# EAGLE design amp_interface_v_1_0 (EAGLE 6.4)
PyRadio
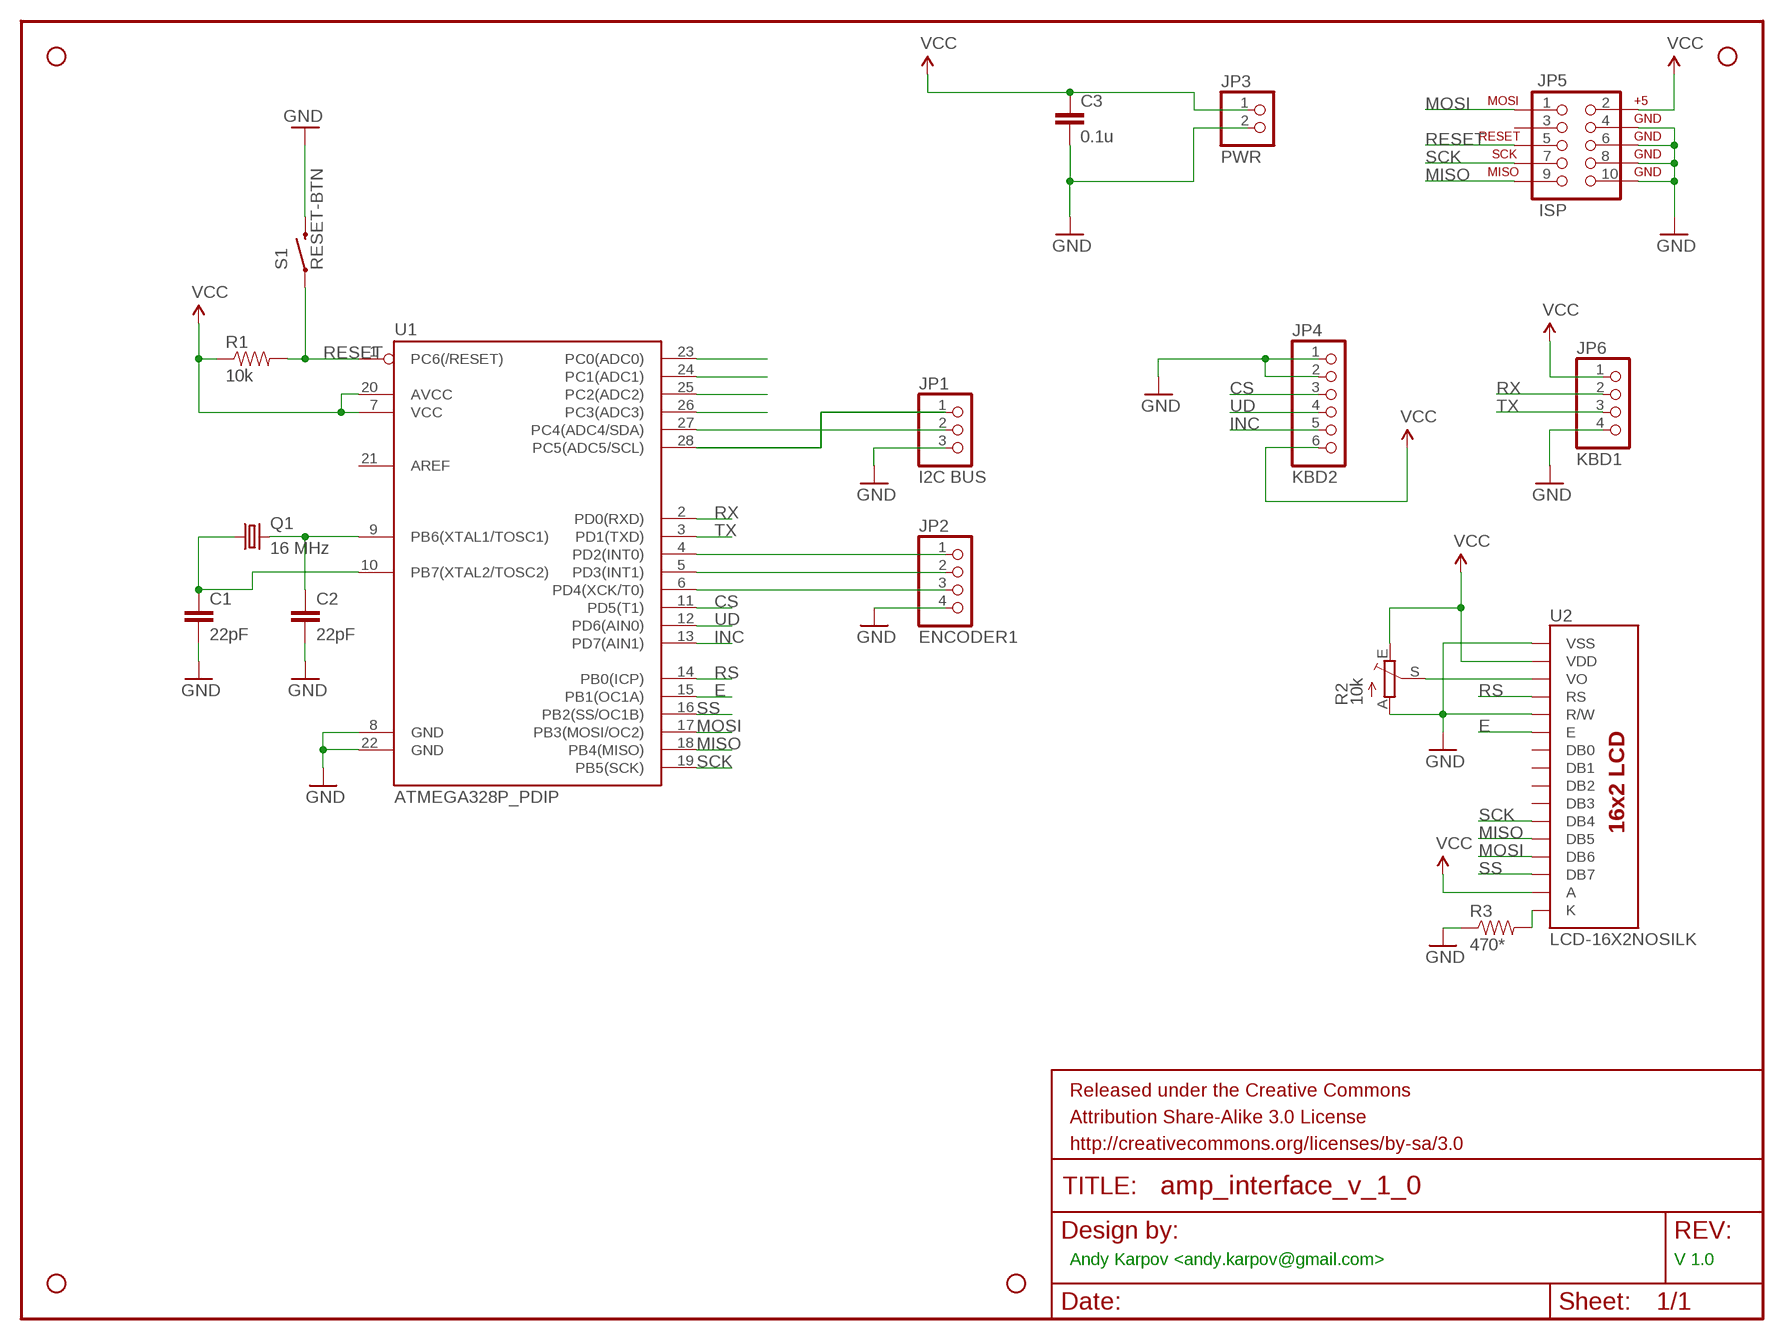
[diagram p0: schematic, sheet 1]

## Parts
C1  22pF  CAPPTH2  [CAP-PTH-SMALL2]
C2  22pF  CAPPTH2  [CAP-PTH-SMALL2]
C3  0.1u  CAPPTH2  [CAP-PTH-SMALL2]
FRAME1  FRAME-LETTER  [CREATIVE_COMMONS]
JP1  I2C BUS  PINHD-1X3  [1X03]
JP2  ENCODER1  PINHD-1X4  [1X04]
JP3  PWR  PINHD-1X2  [1X02]
JP4  KBD2  PINHD-1X6  [1X06]
JP5  ISP  AVR_SPI_PROG2PTH2  [2X5-SHROUDED]
JP6  KBD1  PINHD-1X4  [1X04]
Q1  16 MHz  CRYSTALHC49S  [HC49/S]
R1  10k  RESISTORPTH-1/4W  [AXIAL-0.4]
R2  10k  TRIM_EU-B64Y  [B64Y]
R3  470*  RESISTORPTH-1/4W  [AXIAL-0.4]
S1  RESET-BTN  SWITCH-MOMENTARY-2PTH  [TACTILE-PTH]
STANDOFF1  STAND-OFF  [STAND-OFF]
STANDOFF2  STAND-OFF  [STAND-OFF]
STANDOFF3  STAND-OFF  [STAND-OFF]
STANDOFF4  STAND-OFF  [STAND-OFF]
U1  ATMEGA328P_PDIP  [DIL28-3]
U2  LCD-16X2NOSILK  [LCD-16X2_NOSILK]

## Nets
CS: JP4.3 U1.11(PD5(T1))
E: U1.15(PB1(OC1A)) U2.6(E)
GND: C1.2 C2.2 C3.2 JP1.3 JP2.4 JP3.2 JP4.1 JP4.2 JP5.4 JP5.6 JP5.8 JP5.10 JP6.4 R2.A R3.P$1 S1.3 U1.8(GND) U1.22(GND) U2.1(VSS) U2.5(R/W)
INC: JP4.5 U1.13(PD7(AIN1))
MISO: JP5.9 U1.18(PB4(MISO)) U2.12(DB5)
MOSI: JP5.1 U1.17(PB3(MOSI/OC2)) U2.13(DB6)
N$1: C2.1 Q1.2 U1.9(PB6(XTAL1/TOSC1))
N$2: C1.1 Q1.1 U1.10(PB7(XTAL2/TOSC2))
N$3: R2.S U2.3(VO)
N$4: R3.P$2 U2.16(K)
N$6: JP1.2 U1.27(PC4(ADC4/SDA))
N$7: JP1.1 U1.28(PC5(ADC5/SCL))
N$20: JP2.3 U1.6(PD4(XCK/T0))
N$21: JP2.1 U1.4(PD2(INT0))
N$24: JP2.2 U1.5(PD3(INT1))
PC0: U1.23(PC0(ADC0))
PC1: U1.24(PC1(ADC1))
PC2: U1.25(PC2(ADC2))
PC3: U1.26(PC3(ADC3))
RESET: JP5.5 R1.P$2 S1.1 U1.1(PC6(/RESET))
RS: U1.14(PB0(ICP)) U2.4(RS)
RX: JP6.2 U1.2(PD0(RXD))
SCK: JP5.7 U1.19(PB5(SCK)) U2.11(DB4)
SS: U1.16(PB2(SS/OC1B)) U2.14(DB7)
TX: JP6.3 U1.3(PD1(TXD))
UD: JP4.4 U1.12(PD6(AIN0))
VCC: C3.1 JP3.1 JP4.6 JP5.2 JP6.1 R1.P$1 R2.E U1.7(VCC) U1.20(AVCC) U2.2(VDD) U2.15(A)
Unconnected: JP5.3 U1.21(AREF) U2.7(DB0) U2.8(DB1) U2.9(DB2) U2.10(DB3)

## Notes on the sheet
- Andy Karpov <andy.karpov@gmail.com> | V 1.0

## Library data of the parts
C1-C3 = SparkFun-Passives:CAP: Capacitor Standard 0603 ceramic capacitor, and 0.1" leaded capacitor.
FRAME1 = SparkFun-Aesthetics:FRAME-LETTER: Schematic Frame Standard 8.5x11 US Letter frame
JP1 = pinhead:PINHD-1X3: PIN HEADER
JP2 JP6 = pinhead:PINHD-1X4: PIN HEADER
JP3 = pinhead:PINHD-1X2: PIN HEADER
JP4 = pinhead:PINHD-1X6: PIN HEADER
JP5 = SparkFun-Connectors:AVR_SPI_PROG2: AVR 10-pin ICSP Header This is the standard AVR In Circuit Serial Programming header. Minimal, but includes pin one indicator. Works with standard Olimex programmers. Also look for the 6-pin reduced version. Spark Fun Electronics SKU: PRT-00778
Q1 = crystal:CRYSTAL: CRYSTAL; OC_FARNELL: 1667008; OC_NEWARK: unknown
R1 R3 = SparkFun-Passives:RESISTOR: Resistor Basic schematic elements and footprints for 0603, 1206, and PTH resistors.
R2 = pot:TRIM_EU-: POTENTIOMETER
S1 = SparkFun-Electromechanical:SWITCH-MOMENTARY-2: Various NO switches- pushbuttons, reed, etc
STANDOFF1-STANDOFF4 = SparkFun-Electromechanical:STAND-OFF: #4 Stand Off This is the mechanical footprint for a #4 phillips button head screw. Use the keepout ring to avoid running the screw head into surrounding components. SKU : PRT-00447
U1 = SparkFun-DigitalIC:ATMEGA328P_PDIP: uC used in the Arduino 32kb flash, 1k EEPROM, 2k SRAM This is the through-hole version of this chip.
U2 = SparkFun-Displays:LCD-16X2: Standard text-only 16x2 parallel input LCD

## Board
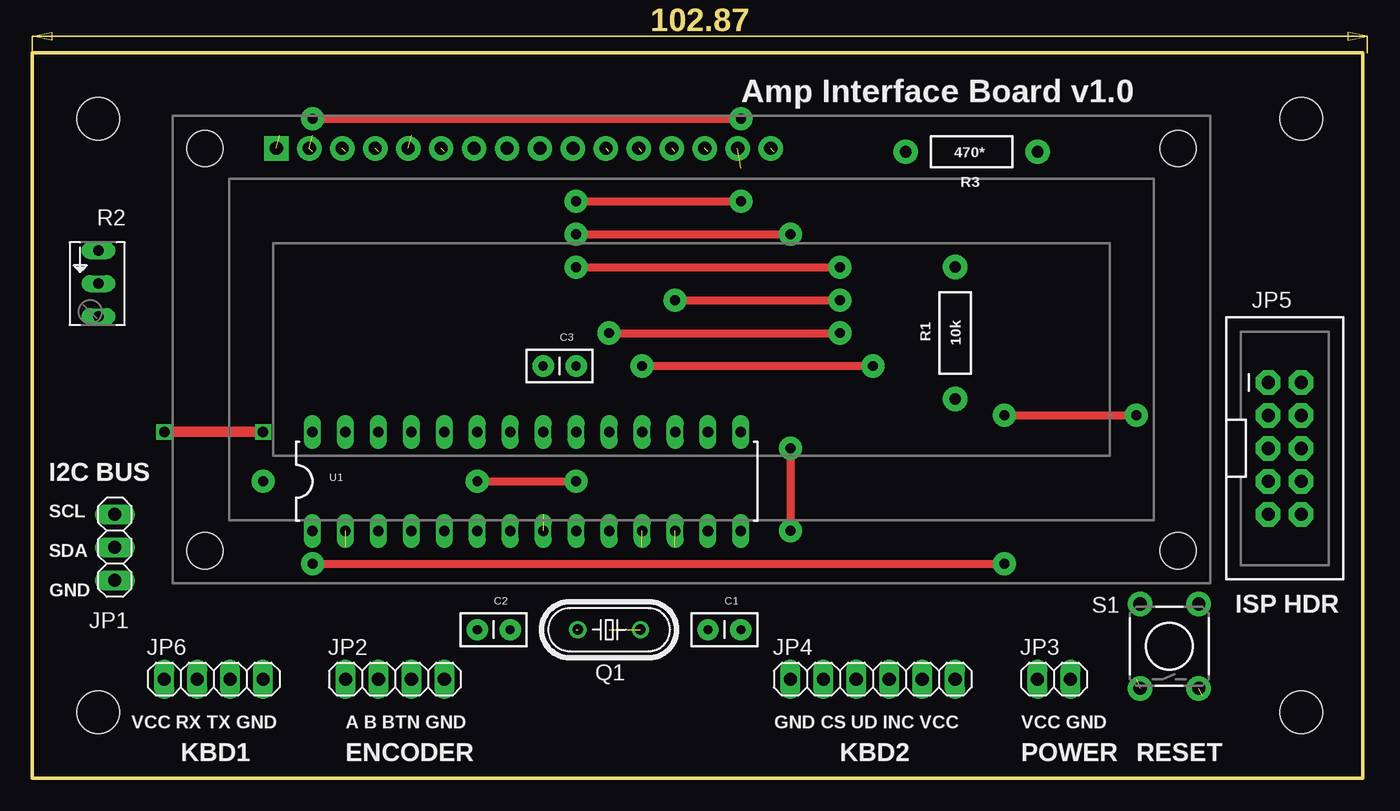
[diagram p1: board, top side]
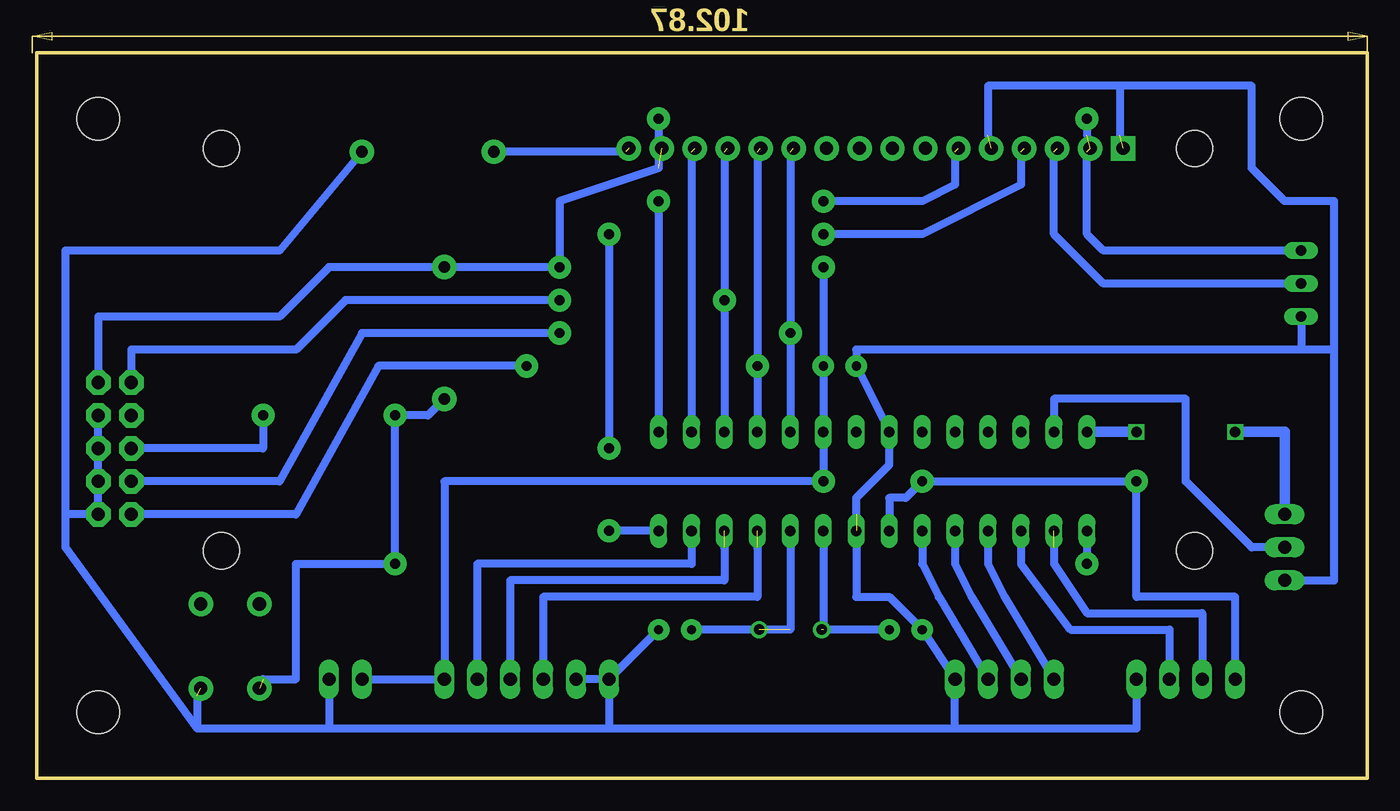
[diagram p2: board, bottom side, seen from below]

Size 102.54 x 55.87 mm. Coordinates in mm from the lower left corner, seen from the top.
Outline: 0,0 102.54,0 102.54,55.87 0,55.87 0,0
Copper layers (1*16): Top 0.035mm / dielectric 1.5mm / Bottom 0.035mm
Design rules "default": minimum track width 10mil, minimum drill 24mil, track to track 8mil, track to pad 8mil, pad to pad 8mil, via to via 8mil, smd to smd 8mil, copper to edge 40mil, drill to drill 8mil, minimum pad ring 10mil, minimum via ring 8mil, stop-mask expansion 4mil, vias tented up to drill 0mil, thermal gap 10mil

### Footprints (pad centres in the part's own frame; a part is rotated, then mirrored left to right if it is on the bottom)
CAP-PTH-SMALL2 = drill 0.7 pad 1.651: 1 0,0; 2 2.54,0
1X03 = drill 1.016 long: 1 -2.54,0; 2 0,0; 3 2.54,0
1X04 = drill 1.016 long: 1 -3.81,0; 2 -1.27,0; 3 1.27,0; 4 3.81,0
1X02 = drill 1.016 long: 1 -1.27,0; 2 1.27,0
1X06 = drill 1.016 long: 1 -6.35,0; 2 -3.81,0; 3 -1.27,0; 4 1.27,0; 5 3.81,0; 6 6.35,0
2X5-SHROUDED = drill 1.016 pad 1.88 octagon: 1 -1.27,5.08; 2 1.27,5.08; 3 -1.27,2.54; 4 1.27,2.54; 5 -1.27,0; 6 1.27,0; 7 -1.27,-2.54; 8 1.27,-2.54; 9 -1.27,-5.08; 10 1.27,-5.08
HC49/S = drill 0.813: 1 -2.413,0; 2 2.413,0
AXIAL-0.4 = drill 0.9 pad 1.88: P$1 -5.08,0; P$2 5.08,0
B64Y = drill 0.813 long: A 2.54,0; E -2.54,0; S 0,0
TACTILE-PTH = drill 1.016 pad 1.88: 1 -3.251,2.261; 2 3.251,2.261; 3 -3.251,-2.261; 4 3.251,-2.261
STAND-OFF = hole 3.302: 0,0
DIL28-3 = drill 0.813 long: 1 -16.51,-3.81; 2 -13.97,-3.81; 3 -11.43,-3.81; 4 -8.89,-3.81; 5 -6.35,-3.81; 6 -3.81,-3.81; 7 -1.27,-3.81; 8 1.27,-3.81; 9 3.81,-3.81; 10 6.35,-3.81; 11 8.89,-3.81; 12 11.43,-3.81; 13 13.97,-3.81; 14 16.51,-3.81; 15 16.51,3.81; 16 13.97,3.81; 17 11.43,3.81; 18 8.89,3.81; 19 6.35,3.81; 20 3.81,3.81; 21 1.27,3.81; 22 -1.27,3.81; 23 -3.81,3.81; 24 -6.35,3.81; 25 -8.89,3.81; 26 -11.43,3.81; 27 -13.97,3.81; 28 -16.51,3.81
LCD-16X2_NOSILK = drill 1.016 pad 1.88 square: 1 -32,15.5 | drill 1.016 pad 1.88: 2 -29.46,15.5; 3 -26.92,15.5; 4 -24.38,15.5; 5 -21.84,15.5; 6 -19.3,15.5; 7 -16.76,15.5; 8 -14.22,15.5; 9 -11.68,15.5; 10 -9.14,15.5; 11 -6.6,15.5; 12 -4.06,15.5; 13 -1.52,15.5; 14 1.02,15.5; 15 3.56,15.5; 16 6.1,15.5 | hole 2.8: -37.5,15.5; -37.5,-15.5; 37.5,15.5; 37.5,-15.5

### Placement (x,y rotation side)
C1  52.07,11.43 0 top
C2  36.83,11.43 180 top
C3  41.91,31.75 180 top
FRAME1  20.32,57.15 0 top
JP1  6.35,17.78 270 top
JP2  27.94,7.62 0 top
JP3  78.74,7.62 0 top
JP4  64.77,7.62 0 top
JP5  96.52,25.4 0 top
JP6  13.97,7.62 0 top
Q1  44.45,11.43 180 top
R1  71.12,34.29 270 top
R2  5.08,38.1 270 top
R3  72.39,48.26 180 top
S1  87.63,10.16 90 top
STANDOFF1  97.79,5.08 0 top
STANDOFF2  5.08,5.08 0 top
STANDOFF3  5.08,50.8 0 top
STANDOFF4  97.79,50.8 0 top
U1  38.1,22.86 0 top
U2  50.8,33.02 0 top

### Tracks (layer width: path | path; a pad name or v marks a point on that pad's centre or on a via)
CS  (1 unrouted)
  Bottom 0.61: 46.99,17.78 46.99,13.97 63.5,13.97 JP4.3
E  (via drill 0.76 pad 1.78)  (1 unrouted)
  Top 0.61: v41.91,44.45 v54.61,44.45
  Bottom 0.61: v54.61,44.45 U1.15 | 31.75,48.26 31.75,45.72 34.29,44.45 v41.91,44.45
GND  (4 unrouted)
  Bottom 0.61: 39.37,20.32 39.37,21.59 36.83,24.13 U1.22 C3.2 39.37,33.02 5.08,33.02 | 31.75,3.81 58.42,3.81 | 58.42,3.81 80.01,3.81 | JP6.4 17.78,3.81 31.75,3.81 | 31.75,3.81 JP2.4 C2.2 36.83,13.97 39.37,13.97 U1.8 | JP5.4 JP5.6 JP5.8 JP5.10 100.33,20.32 | R3.P$1 83.82,40.64 100.33,40.64 100.33,20.32 | 100.33,20.32 100.33,17.78 90.17,3.81 | JP4.1 JP4.2 | JP3.2 80.01,3.81 | 80.01,3.81 90.17,3.81 | JP1.3 2.54,15.24 2.54,33.02 | C1.2 JP4.1 | JP4.1 58.42,3.81 | 90.17,6.35 90.17,3.81 | 2.54,33.02 5.08,33.02 | 2.54,33.02 2.54,44.45 6.35,44.45 8.89,46.99 8.89,53.34 19.05,53.34 | 19.05,53.34 29.21,53.34 29.21,49.53 | 19.05,53.34 19.05,49.53 | R2.A 5.08,33.02
INC
  Bottom 0.61: U1.13 52.07,16.51 68.58,16.51 JP4.5
MISO  (via drill 0.76 pad 1.78)  (1 unrouted)
  Top 0.61: v46.99,31.75 v64.77,31.75
  Bottom 0.61: 46.99,48.26 v46.99,31.75 U1.18 | v64.77,31.75 76.2,31.75 82.55,20.32 JP5.9
MOSI  (via drill 0.76 pad 1.78)  (1 unrouted)
  Top 0.61: v49.53,36.83 v62.23,36.83
  Bottom 0.61: 49.53,48.26 v49.53,36.83 U1.17 | v62.23,36.83 78.74,36.83 82.55,33.02 95.25,33.02 JP5.1
N$1  (1 unrouted)
  Bottom 0.61: U1.9 41.91,11.43 C2.1
N$2  (1 unrouted)
  Bottom 0.61: U1.10 44.45,11.43 C1.1
N$3  (1 unrouted)
  Bottom 0.61: R2.S 20.32,38.1 24.13,41.91 24.13,48.26
N$4  (1 unrouted)
  Bottom 0.61: 57.15,48.26 R3.P$2
N$6
  Bottom 0.61: JP1.2 8.89,17.78 13.97,22.86 13.97,29.21 24.13,29.21 U1.27
N$7  (via drill 0.81)
  Top 0.813: v10.16,26.67 v17.78,26.67
  Bottom 0.813: v10.16,26.67 6.35,26.67 JP1.1 | v17.78,26.67 U1.28
N$20
  Bottom 0.61: U1.6 34.29,16.51 33.02,13.97 JP2.3
N$21
  Bottom 0.61: U1.4 29.21,16.51 27.94,13.97 JP2.1
N$24
  Bottom 0.61: U1.5 31.75,16.51 30.48,13.97 JP2.2
RESET  (via drill 0.76 pad 1.78)  (1 unrouted)
  Top 0.61: v74.93,27.94 v85.09,27.94 | v21.59,16.51 v74.93,16.51
  Bottom 0.61: v85.09,27.94 85.09,25.4 JP5.5 | U1.1 v21.59,16.51 | 85.09,7.62 82.55,7.62 82.55,16.51 v74.93,16.51 v74.93,27.94 72.39,27.94 R1.P$2
RS  (via drill 0.76 pad 1.78)  (1 unrouted)
  Top 0.61: v41.91,41.91 v58.42,41.91 | v58.42,25.4 v58.42,19.05
  Bottom 0.61: U1.14 v58.42,19.05 | 26.67,48.26 26.67,45.72 34.29,41.91 v41.91,41.91 | v58.42,41.91 v58.42,25.4
RX  (1 unrouted)
  Bottom 0.61: 24.13,17.78 24.13,16.51 21.59,12.7 12.7,12.7 JP6.2
SCK  (via drill 0.76 pad 1.78)  (1 unrouted)
  Top 0.61: v44.45,34.29 v62.23,34.29
  Bottom 0.61: 44.45,48.26 v44.45,34.29 U1.19 | v62.23,34.29 77.47,34.29 83.82,22.86 JP5.7
SS  (1 unrouted)
  Bottom 0.61: 52.07,48.26 U1.16
TX
  Bottom 0.61: U1.3 26.67,16.51 22.86,11.43 15.24,11.43 JP6.3
UD  (1 unrouted)
  Bottom 0.61: 49.53,17.78 49.53,15.24 66.04,15.24 JP4.4
VCC  (via drill 0.76 pad 1.78)  (3 unrouted)
  Top 0.61: v41.91,39.37 v62.23,39.37 | v34.29,22.86 v41.91,22.86 | v21.59,50.8 v54.61,50.8
  Bottom 0.61: v41.91,39.37 C3.1 U1.20 v41.91,22.86 71.12,22.86 JP4.6 JP3.1 | R2.E 20.32,40.64 21.59,41.91 21.59,48.26 | v54.61,50.8 54.61,46.99 62.23,44.45 v62.23,39.37 R1.P$1 80.01,39.37 83.82,35.56 97.79,35.56 JP5.2 | U1.7 36.83,21.59 35.56,21.59 v34.29,22.86 v17.78,22.86 17.78,13.97 10.16,13.97 JP6.1 | v21.59,50.8 21.59,49.53

### Text on the board
tPlace: Amp Interface Board v1.0 | I2C BUS | SCL / / SDA / / GND | ISP HDR | VCC RX TX GND | A B BTN GND | GND CS UD INC VCC | VCC GND | KBD1 | ENCODER | KBD2 | POWER | RESET